# Altium project MarioKarCB.PrjPcb
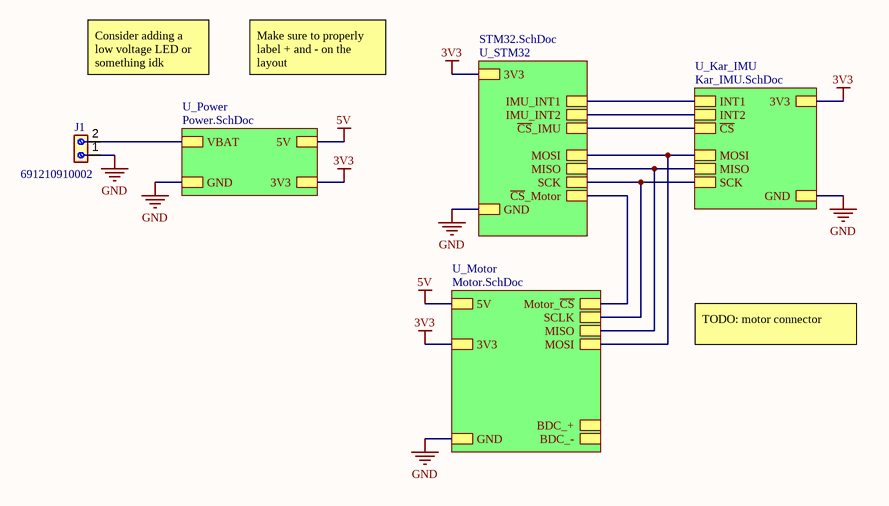
[diagram p0: Kar_PCB.SchDoc]
CAGE_CODE: ?????; CONTRACT_NUMBER: <CONTRACT NO>; DOC_NO_ASSY_DWG: <ASSY DWG NO>; DOC_NO_BOM: <BOM DOC NO>; DOC_NO_FAB_DWG: <FAB DWG NO>; DOC_NO_SCH_DWG: <SCH DWG NO>; PCB_2_DEC_TOL: +/-.01; PCB_3_DEC_TOL: +/-.010; PCB_ANG_TOL: +/-1/2; PCB_ASSEMBLY_NO: <PCB ASSY NO>; PCB_CHECKER: - -----; PCB_CHECKER_APP_DATE: --/--/----; PCB_DESIGNER: - -----; PCB_DESIGNER_APP_DATE: --/--/----; PCB_DWG_NO: <PCB DWG NO>; PCB_ENGINEER: - -----; PCB_ENGINEER_APP_DATE: --/--/----; PCB_PART_NUMBER: <PCB PN>; PCB_REV: A; SCH_REV: A
7 sheets, 72 parts. Net scope: strictly hierarchical (ports join the sheet entries above them; power ports are local).
Sheets:
  Kar_PCB.SchDoc
    U_Motor = Motor.SchDoc
    U_Power = Power.SchDoc
    U_STM32 = STM32.SchDoc
    U_Kar_IMU = Kar_IMU.SchDoc
  Finger_IMU_PCB.SchDoc
  Glove_PCB.SchDoc

## Sheet Kar_PCB.SchDoc
size 241 x 190 mm; SheetNumber: 1; SheetTotal: 5; ENG_APP_DATE: --/--/--; DSN_APP_DATE: --/--/--; CHK_APP_DATE: --/--/--

### Parts
J1  691210910002  [691210910002]

### Sub-sheets
U_Kar_IMU = Kar_IMU.SchDoc: 3V3, GND, ~{CS}, SCK, MISO, MOSI, INT1, INT2
U_Motor = Motor.SchDoc: 5V, GND, BDC_+, BDC_-, MOSI, Motor_~{CS}, SCLK, 3V3, MISO
U_Power = Power.SchDoc: VBAT, GND, 5V, 3V3
U_STM32 = STM32.SchDoc: MOSI, MISO, SCK, 3V3, GND, ~{CS}_Motor, ~{CS}_IMU, IMU_INT2, IMU_INT1

### Nets
3V3: sheet U_Motor/3V3, sheet U_Power/3V3, sheet U_STM32/3V3, sheet U_Kar_IMU/3V3
5V: sheet U_Motor/5V, sheet U_Power/5V
GND: J1.1 ; sheet U_Motor/GND, sheet U_Power/GND, sheet U_STM32/GND, sheet U_Kar_IMU/GND
VBAT: J1.2 ; sheet U_Power/VBAT
NetMT1_4: sheet U_STM32/IMU_INT1, sheet U_Kar_IMU/INT1
NetMT1_9: sheet U_STM32/IMU_INT2, sheet U_Kar_IMU/INT2
NetMT1_12: sheet U_STM32/~{CS}_IMU, sheet U_Kar_IMU/~{CS}
NetMT1_13: sheet U_Motor/SCLK, sheet U_STM32/SCK, sheet U_Kar_IMU/SCK
NetMT1_14: sheet U_Motor/MOSI, sheet U_STM32/MOSI, sheet U_Kar_IMU/MOSI
NetR12_1: sheet U_Motor/MISO, sheet U_STM32/MISO, sheet U_Kar_IMU/MISO
NetR?#3_2: sheet U_Motor/Motor_~{CS}, sheet U_STM32/~{CS}_Motor

### Notes on the sheet
- Consider adding a low voltage LED or something idk
- Make sure to properly label + and - on the layout
- TODO: motor connector
- DWG. NO.
- REV.
- SHT.
- THIS DOCUMENT AND THE DATA DISCLOSED HEREIN OR HEREWITH IS THE PROPERTY OF ALTIUM LIMITED AND MAY BE FREELY DISTRIBUTED IN WHOLE. NO RIGHTS ARE RESERVED OR EXPRESS OR IMPLIED WARANTEE GIVEN.
- REVISION
- DESCRIPTION
- DATE
- APPROVED
- ENG:
- APPROVALS
- PROJECT
- DSN:
- CHK:
- REFERENCE DOCUMENTS
- PROJECT REVISION:
- TITLE
- DOCUMENT REVISION:
- DESIGN ITEM:
- BOM:
- FAB DWG:
- PCB DWG:
- ASSY DWG:
- SCALE:
- SIZE
- B
- CAGE CODE
- FILE NAME
- DWG NO.
- SHEET
- OF
- REV

### Library data of the parts
J1 = 691210910002: MF: {'manufacturer': u'W\xfcrth Elektronik'}; Package: None; Price: None; Value: *; MP: 691210910002; Availability: Unavailable

## Sheet Motor.SchDoc
size A; SheetNumber: 3; SheetTotal: 7
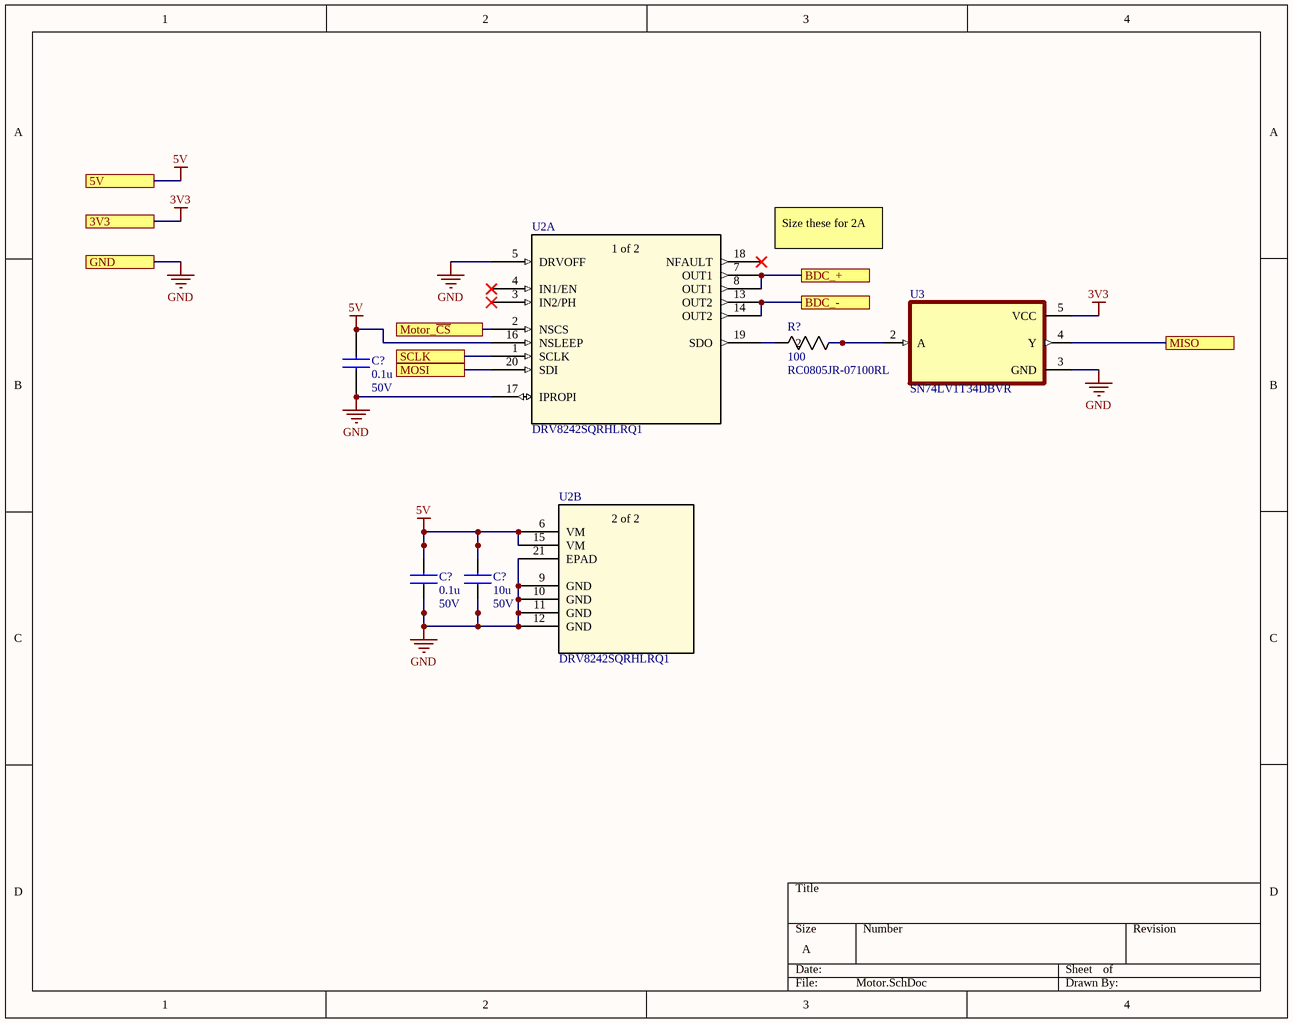
[diagram p1: Motor.SchDoc]

### Parts
(Parts that share a designator on the sheet are numbered #1, #2 ... from top to bottom, then left to right.)
C?#1  value 0.1u  Rated Voltage: 50V  [CAPC2012X145N]  (hidden comment: KAM21BR71H104JM)
C?#2  value 0.1u  Rated Voltage: 50V  [CAPC2012X145N]  (hidden comment: KAM21BR71H104JM)
C?#3  value 10u  Rated Voltage: 50V  [CAPC2012X145N]  (hidden comment: C2012X5R1H106K125AC)
R?#1  RC0805JR-07100RL  value 100  [RC0805N_YAG]
U2  DRV8242SQRHLRQ1  [VQFN20_RHL_TEX]  (parts A,B of 2)
U3  SN74LV1T34DBVR  [SOT95P280X145-5N]

### Ports
3V3, 5V, BDC_+, BDC_-, GND, MISO, MOSI, Motor_~{CS}, SCLK

### Nets
3V3: U3.5(VCC) ; port 3V3
5V: C?#1.2 C?#2.2 C?#3.2 U2.6(VM) U2.15(VM) U2.16(NSLEEP) ; port 5V
GND: C?#1.1 C?#2.1 C?#3.1 U2.5(DRVOFF) U2.9(GND) U2.10(GND) U2.11(GND) U2.12(GND) U2.17(IPROPI) U2.21(EPAD) U3.3(GND) ; port GND
NetMT1_13: U2.1(SCLK) ; port SCLK
NetMT1_14: U2.20(SDI) ; port MOSI
NetR12_1: U3.4(Y) ; port MISO
NetR?#1_1: R?#1.1 U3.2(A)
NetR?#1_2: R?#1.2 U2.19(SDO)
NetR?#3_2: U2.2(NSCS) ; port Motor_~{CS}
NetU2_7: U2.7(OUT1) U2.8(OUT1) ; port BDC_+
NetU2_13: U2.13(OUT2) U2.14(OUT2) ; port BDC_-

Not connected (* = marked no-connect by the designer): U2 3(IN2/PH)* 4(IN1/EN)* 18(NFAULT)*

### Notes on the sheet
- Size these for 2A
- (in symbol DRV8242SQRHLRQ1, part A) 1 of 2
- (in symbol DRV8242SQRHLRQ1, part B) 2 of 2

### Library data of the parts
C?#1 C?#2 = KAM21BR71H104JM: Multilayer Ceramic Chip Capacitors, Capacitance=0.1u; Manufacturer_Part_Number: KAM21BR71H104JM
C?#3 = C2012X5R1H106K125AC: Multilayer Ceramic Chip Capacitors, Capacitance=10?F, LxWxT:2x1.25x1.25mm; Manufacturer_Name: TDK; Geometry.Height: 1.45mm; Mouser Part Number: 810-C2012X5R1H106K12; Mouser Price/Stock: https://www.mouser.co.uk/ProductDetail/TDK/C2012X5R1H106K125AC?qs=rSMjJ%252B1ewcQGpfDVduhUmg%3D%3D; Manufacturer_Part_Number: C2012X5R1H106K125AC; Datasheet Link: https://product.tdk.com/info/en/catalog/datasheets/mlcc_commercial_midvoltage_en.pdf
R?#1 = RC0805JR-07100RL: RES 0805 100 5% 1/8W; Manufacturer_Name: Yageo; Manufacturer_Part_Number: RC0805JR-07100RL; Tolerance: 5%
U2 = DRV8242SQRHLRQ1: Automotive, 40-V 6-A H-bridge driver with integrated current sensing and feedback 20-VQFN -40 to 125; Manufacturer_Name: Texas Instruments; Type: Power Management; Copyright: Copyright (C) 2025 Ultra Librarian. All rights reserved.; Manufacturer_Part_Number: DRV8242SQRHLRQ1; Datasheet: https://www.ti.com/lit/gpn/drv8242-q1; RefDes: RefDes
U3 = SN74LV1T34DBVR: Single Power Supply BUFFER Logic Level Shifter (no enable); MF: Texas Instruments; SnapEDA_Link: https://www.snapeda.com/parts/SN74LV1T34DBVR/Texas+Instruments/view-part/?ref=snap; Package: SOT-23-5 Texas Instruments; Value: *; MP: SN74LV1T34DBVR; Check_prices: https://www.snapeda.com/parts/SN74LV1T34DBVR/Texas+Instruments/view-part/?ref=eda

## Sheet Power.SchDoc
size A; SheetNumber: 2; SheetTotal: 7
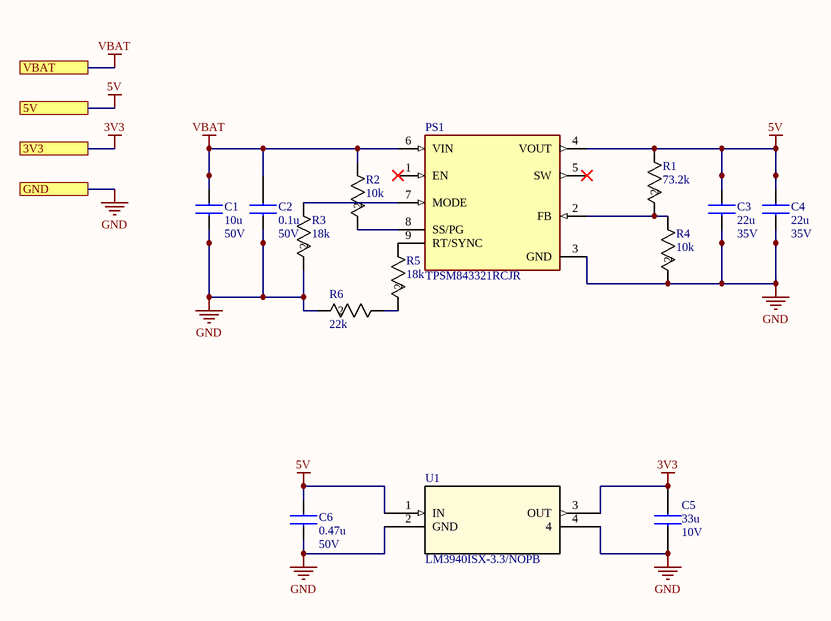
[diagram p2: Power.SchDoc]

### Parts
C1  value 10u  Rated Voltage: 50V  [CAPC2012X145N]  (hidden comment: C2012X5R1H106K125AC)
C2  value 0.1u  Rated Voltage: 50V  [CAPC2012X145N]  (hidden comment: KAM21BR71H104JM)
C3  value 22u  Rated Voltage: 35V  [CAPC2012X145N]  (hidden comment: C2012X5R1V226M125AC)
C4  value 22u  Rated Voltage: 35V  [CAPC2012X145N]  (hidden comment: C2012X5R1V226M125AC)
C5  value 33u  Rated Voltage: 10V  [CAPC2012X145N]  (hidden comment: C2012X5R1A336M125AC)
C6  value 0.47u  Rated Voltage: 50V  [CAPC2012X145N]  (hidden comment: GCM21BR71H474KA55K)
PS1  TPSM843321RCJR  [MODULE_TPSM843321RCJR]
R1  value 73.2k  [RC0805N_YAG]  (hidden comment: RC0805FR-0773K2L)
R2  value 10k  [RC0805N_YAG]  (hidden comment: RC0805FR-0710KL)
R3  value 18k  [RC0805N_YAG]  (hidden comment: RC0805FR-0718KL)
R4  value 10k  [RC0805N_YAG]  (hidden comment: RC0805FR-0710KL)
R5  value 18k  [RC0805N_YAG]  (hidden comment: RC0805FR-0718KL)
R6  value 22k  [RC0805N_YAG]  (hidden comment: RC0805FR-0722KL)
U1  LM3940ISX-3.3/NOPB  [TS3B]

### Ports
3V3, 5V, GND, VBAT

### Nets
3V3: C5.2 U1.3(OUT) ; port 3V3
5V: C3.2 C4.2 C6.2 PS1.4(VOUT) R1.1 U1.1(IN) ; port 5V
GND: C1.1 C2.1 C3.1 C4.1 C5.1 C6.1 PS1.3(GND) R3.2 R4.2 R6.2 U1.2(GND) U1.4 ; port GND
VBAT: C1.2 C2.2 PS1.6(VIN) R2.1 ; port VBAT
NetPS1_2: PS1.2(FB) R1.2 R4.1
NetPS1_7: PS1.7(MODE) R3.1
NetPS1_8: PS1.8(SS/PG) R2.2
NetPS1_9: PS1.9(RT/SYNC) R5.1
NetR5_2: R5.2 R6.1

Not connected (* = marked no-connect by the designer): PS1 1(EN)* 5(SW)*

### Library data of the parts
C1 = C2012X5R1H106K125AC: as C?#3 on sheet Motor; Mouser Part Number: 810-C2012X5R1H106K12; Mouser Price/Stock: https://www.mouser.co.uk/ProductDetail/TDK/C2012X5R1H106K125AC?qs=rSMjJ%252B1ewcQGpfDVduhUmg%3D%3D; Manufacturer_Part_Number: C2012X5R1H106K125AC; Datasheet Link: https://product.tdk.com/info/en/catalog/datasheets/mlcc_commercial_midvoltage_en.pdf
C2 = KAM21BR71H104JM: as C?#1 on sheet Motor; Manufacturer_Part_Number: KAM21BR71H104JM
C3 C4 = C2012X5R1V226M125AC: Multilayer Ceramic Chip Capacitors, Capacitance=22u; Manufacturer_Part_Number: C2012X5R1V226M125AC
C5 = C2012X5R1A336M125AC: Multilayer Ceramic Chip Capacitors, Capacitance=33u; Manufacturer_Part_Number: C2012X5R1A336M125AC
C6 = GCM21BR71H474KA55K: Multilayer Ceramic Chip Capacitors, Capacitance=0.47u; Manufacturer_Part_Number: GCM21BR71H474KA55K
PS1 = TPSM843321RCJR: Non-Isolated PoL Module DC DC Converter 1 Output 5V 3A 3.8V - 18V Input; MF: Texas Instruments; SnapEDA_Link: https://www.snapeda.com/parts/TPSM843321RCJR/Texas+Instruments/view-part/?ref=snap; Package: None; Value: *; MP: TPSM843321RCJR; Check_prices: https://www.snapeda.com/parts/TPSM843321RCJR/Texas+Instruments/view-part/?ref=eda
R1 = RC0805FR-0773K2L: RES 0805 73.2k 1% 1/8W; Manufacturer_Name: Yageo; Manufacturer_Part_Number: RC0805FR-0773K2L; Tolerance: 1%
R2 R4 = RC0805FR-0710KL: RES 0805 10k 1% 1/8W; Manufacturer_Name: Yageo; Manufacturer_Part_Number: RC0805FR-0710KL; Tolerance: 1%
R3 R5 = RC0805FR-0718KL: RES 0805 18k 1% 1/8W; Manufacturer_Name: Yageo; Manufacturer_Part_Number: RC0805FR-0718KL; Tolerance: 1%
R6 = RC0805FR-0722KL: RES 0805 22k 1% 1/8W; Manufacturer_Name: Yageo; Manufacturer_Part_Number: RC0805FR-0722KL; Tolerance: 1%
U1 = LM3940ISX-3.3NOPB: 1-A, low-dropout voltage regulator for 5-V to 3.3-V conversion 3-DDPAK/TO-263 -40 to 125; Manufacturer_Name: Texas Instruments; Type: LM3940IS-3.3; Copyright: Copyright (C) 2025 Ultra Librarian. All rights reserved.; Manufacturer_Part_Number: LM3940ISX-3.3/NOPB; Datasheet: https://www.ti.com/lit/gpn/lm3940; RefDes: RefDes

## Sheet STM32.SchDoc
size A; SheetNumber: 4; SheetTotal: 7
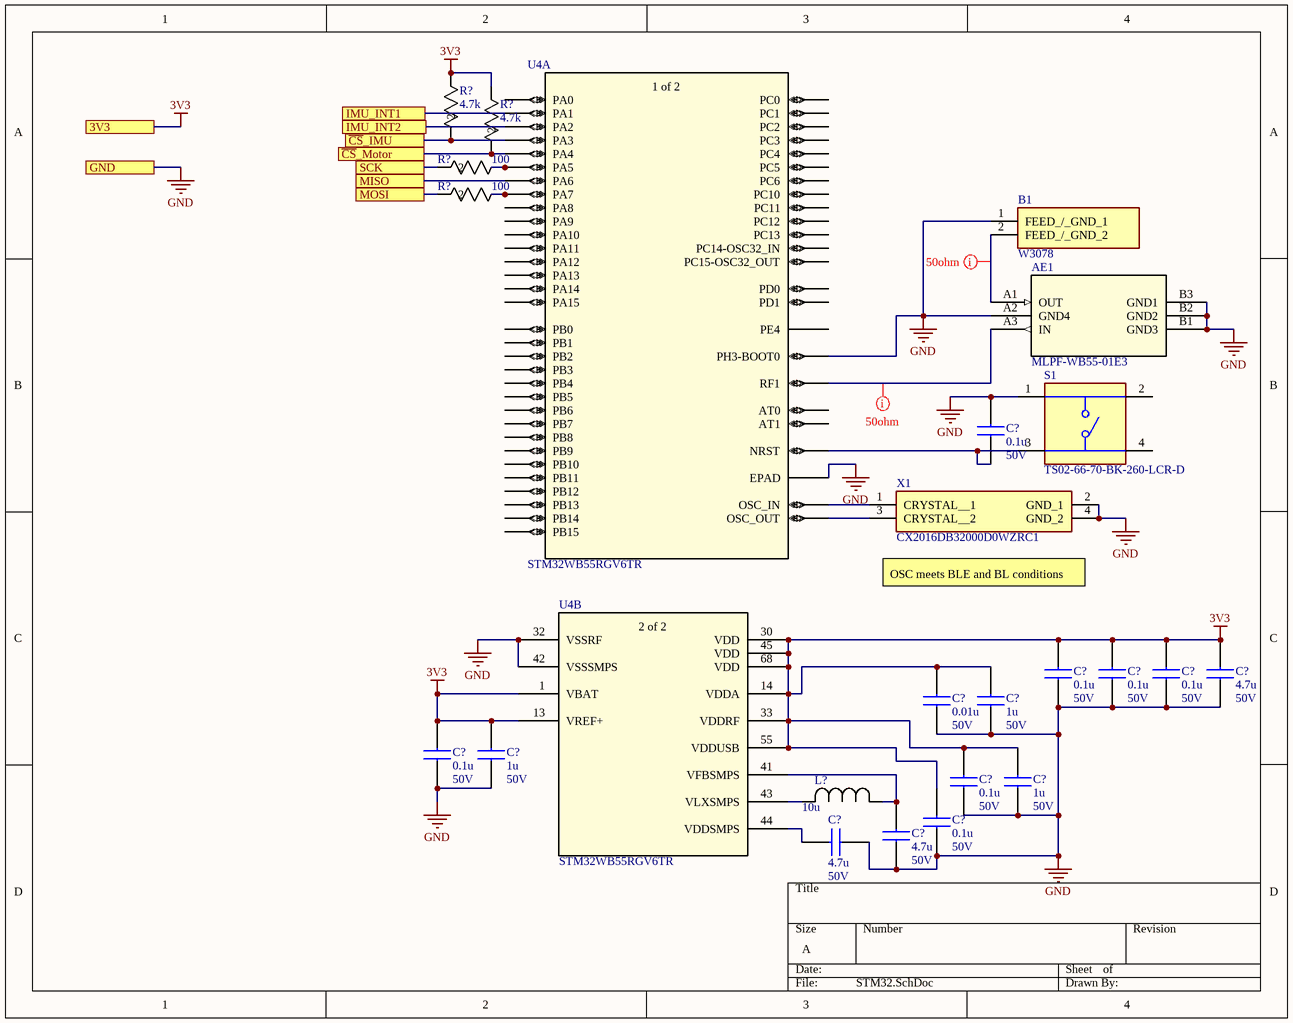
[diagram p3: STM32.SchDoc]

### Parts
(Parts that share a designator on the sheet are numbered #1, #2 ... from top to bottom, then left to right.)
AE1  MLPF-WB55-01E3  [MLPF-WB55-01E3_STM]
B1  W3078  [W3078]
C?#4  value 0.1u  Rated Voltage: 50V  [CAPC2012X145N]  (hidden comment: KAM21BR71H104JM)
C?#5  value 0.1u  Rated Voltage: 50V  [CAPC2012X145N]  (hidden comment: KAM21BR71H104JM)
C?#6  value 0.1u  Rated Voltage: 50V  [CAPC2012X145N]  (hidden comment: KAM21BR71H104JM)
C?#7  value 0.1u  Rated Voltage: 50V  [CAPC2012X145N]  (hidden comment: KAM21BR71H104JM)
C?#8  value 4.7u  Rated Voltage: 50V  [CAPC2012X145N]  (hidden comment: C2012X5R1H475M125AB)
C?#9  value 0.01u  Rated Voltage: 50V  [CAPC2012X145N]  (hidden comment: KAM21BR71H103KT)
C?#10  value 1u  Rated Voltage: 50V  [CAPC2012X145N]  (hidden comment: KGM21AR51H105KU)
C?#11  value 0.1u  Rated Voltage: 50V  [CAPC2012X145N]  (hidden comment: KAM21BR71H104JM)
C?#12  value 1u  Rated Voltage: 50V  [CAPC2012X145N]  (hidden comment: KGM21AR51H105KU)
C?#13  value 0.1u  Rated Voltage: 50V  [CAPC2012X145N]  (hidden comment: KAM21BR71H104JM)
C?#14  value 1u  Rated Voltage: 50V  [CAPC2012X145N]  (hidden comment: KGM21AR51H105KU)
C?#15  value 4.7u  Rated Voltage: 50V  [CAPC2012X145N]  (hidden comment: C2012X5R1H475M125AB)
C?#16  value 0.1u  Rated Voltage: 50V  [CAPC2012X145N]  (hidden comment: KAM21BR71H104JM)
C?#17  value 4.7u  Rated Voltage: 50V  [CAPC2012X145N]  (hidden comment: C2012X5R1H475M125AB)
L?  value 10u  [IND_LQM21FN100M80L_MUR]  (hidden comment: LQM21FN100M80L)
R?#2  value 4.7k  [RC0805N_YAG]  (hidden comment: RC0805JR-074K7L)
R?#3  value 4.7k  [RC0805N_YAG]  (hidden comment: RC0805JR-074K7L)
R?#4  value 100  [RC0805N_YAG]  (hidden comment: RC0805JR-07100RL)
R?#5  value 100  [RC0805N_YAG]  (hidden comment: RC0805JR-07100RL)
S1  TS02-66-70-BK-260-LCR-D  [SW_TS02-66-70-BK-260-LCR-D]
U4  STM32WB55RGV6TR  [VFQFN68-8x8mm]  (parts A,B of 2)
X1  CX2016DB32000D0WZRC1  [CX2016DB32000D0WZRC1]

### Ports
3V3, GND, IMU_INT1, IMU_INT2, MISO, MOSI, SCK, ~{CS}_IMU, ~{CS}_Motor

### Nets
3V3: C?#5.2 C?#6.2 C?#7.2 C?#8.2 C?#9.2 C?#10.2 C?#11.2 C?#12.2 C?#13.2 C?#14.2 C?#16.2 R?#2.1 R?#3.1 U4.1(VBAT) U4.13(VREF+) U4.14(VDDA) U4.30(VDD) U4.33(VDDRF) U4.45(VDD) U4.55(VDDUSB) U4.68(VDD) ; port 3V3
GND: AE1.A2(GND4) AE1.B1(GND3) AE1.B2(GND2) AE1.B3(GND1) B1.1(FEED_/_GND_1) C?#4.2 C?#5.1 C?#6.1 C?#7.1 C?#8.1 C?#9.1 C?#10.1 C?#11.1 C?#12.1 C?#13.1 C?#14.1 C?#15.1 C?#16.1 C?#17.1 S1.1 U4.5(PH3-BOOT0) U4.32(VSSRF) U4.42(VSSSMPS) U4.69(EPAD) X1.2(GND_1) X1.4(GND_2) ; port GND
NetAE1_A1: AE1.A1(OUT) B1.2(FEED_/_GND_2)
NetAE1_A3: AE1.A3(IN) U4.31(RF1)
NetC?#4_1: C?#4.1 S1.3 U4.8(NRST)
NetC?#15_2: C?#15.2 U4.44(VDDSMPS)
NetC?#17_2: C?#17.2 L?.1 U4.41(VFBSMPS)
NetL?_2: L?.2 U4.43(VLXSMPS)
NetMT1_4: U4.16(PA1) ; port IMU_INT1
NetMT1_9: U4.17(PA2) ; port IMU_INT2
NetMT1_12: R?#2.2 U4.18(PA3) ; port ~{CS}_IMU
NetMT1_13: R?#4.2 ; port SCK
NetMT1_14: R?#5.2 ; port MOSI
NetR12_1: U4.21(PA6) ; port MISO
NetR?#3_2: R?#3.2 U4.19(PA4) ; port ~{CS}_Motor
NetR?#4_1: R?#4.1 U4.20(PA5)
NetR?#5_1: R?#5.1 U4.22(PA7)
NetU4_34: U4.34(OSC_OUT) X1.3(CRYSTAL__2)
NetU4_35: U4.35(OSC_IN) X1.1(CRYSTAL__1)

Not connected (* = marked no-connect by the designer): S1 2 4; U4 2(PC13) 3(PC14-OSC32_IN) 4(PC15-OSC32_OUT) 6(PB8) 7(PB9) 9(PC0) 10(PC1) 11(PC2) 12(PC3) 15(PA0) 23(PA8) 24(PA9) 25(PC4) 26(PC5) 27(PB2) 28(PB10) 29(PB11) 36(AT0) 37(AT1) 38(PB0) 39(PB1) 40(PE4) 46(PB12) 47(PB13) 48(PB14) 49(PB15) 50(PC6) 51(PA10) 52(PA11) 53(PA12) 54(PA13) 56(PA14) 57(PA15) 58(PC10) 59(PC11) 60(PC12) 61(PD0) 62(PD1) 63(PB3) 64(PB4) 65(PB5) 66(PB6) 67(PB7)

### Layout directives
mark named 50ohm: NetAE1_A1, NetAE1_A3

### Notes on the sheet
- (near X1) OSC meets BLE and BL conditions
- (in symbol STM32WB55RGV6TR, part A) 1 of 2
- (in symbol STM32WB55RGV6TR, part B) 2 of 2

### Library data of the parts
AE1 = MLPF-WB55-01E3: 2.4 GHz Matched filter companion chip for STM32WB55Cx and STM32WB55Rx; Manufacturer_Name: STMicroelectronics; Copyright: Copyright (C) 2025 Ultra Librarian. All rights reserved.; Manufacturer_Part_Number: MLPF-WB55-01E3; Datasheet: https://www.st.com/resource/en/datasheet/mlpf-wb55-01e3.pdf; RefDes: RefDes; Type: Type
B1 = W3078: Antennas CERAMIC W3078 GC380H N; Manufacturer_Name: PULSE; Geometry.Height: 1.2mm; Mouser Part Number: 673-W3078; Mouser Price/Stock: https://www.mouser.co.uk/ProductDetail/Pulse-Electronics/W3078?qs=k0bvAmZt86CkgrK3%2FGxl6Q%3D%3D; Manufacturer_Part_Number: W3078; Datasheet Link: https://datasheet.datasheetarchive.com/originals/distributors/DKDS-10/182581.pdf
C?#4-C?#7 C?#11 C?#13 C?#16 = KAM21BR71H104JM: as C?#1 on sheet Motor; Manufacturer_Part_Number: KAM21BR71H104JM
C?#8 C?#15 C?#17 = C2012X5R1H475M125AB: Multilayer Ceramic Chip Capacitors, Capacitance=4.7u; Manufacturer_Part_Number: GCM21BR71H474KA55K
C?#9 = KAM21BR71H103KT: Multilayer Ceramic Chip Capacitors, Capacitance=0.01u; Manufacturer_Part_Number: KAM21BR71H103KT
C?#10 C?#12 C?#14 = KGM21AR51H105KU: Multilayer Ceramic Chip Capacitors, Capacitance=1u; Manufacturer_Part_Number: KGM21AR51H105KU
L? = LQM21FN100M80L: No Description Available; Manufacturer_Name: Murata; Copyright: Copyright (C) 2025 Ultra Librarian. All rights reserved.; Manufacturer_Part_Number: LQM21FN100M80L
R?#2 R?#3 = RC0805JR-074K7L: RES 0805 4.7k 5% 1/8W; Manufacturer_Name: Yageo; Manufacturer_Part_Number: RC0805JR-074K7L; Tolerance: 5%
R?#4 R?#5 = RC0805JR-07100RL: as R?#1 on sheet Motor; Manufacturer_Part_Number: RC0805JR-07100RL; Tolerance: 5%
S1 = TS02-66-70-BK-260-LCR-D: 6 x 6 mm, 7 mm Actuator Height, 260 gf, Black, Long Crimped, Through Hole, SPST, Tactile Switch; MF: Same Sky; SnapEDA_Link: https://www.snapeda.com/parts/TS02-66-70-BK-260-LCR-D/Same+Sky/view-part/?ref=snap; Package: None; Value: *; MP: TS02-66-70-BK-260-LCR-D; Check_prices: https://www.snapeda.com/parts/TS02-66-70-BK-260-LCR-D/Same+Sky/view-part/?ref=eda
U4 = STM32WB55RGV6TR: Ultra-low-power dual core Arm Cortex-M4 MCU 64 MHz, Cortex-M0+ 32 MHz with 1 Mbyte of Flash memory, Bluetooth LE 5.4, 802.15.4, Zigbee, Thread, Matter, USB, LCD, AES-256; Manufacturer_Name: STMicroelectronics; Copyright: Copyright (C) 2025 Ultra Librarian. All rights reserved.; Manufacturer_Part_Number: STM32WB55RGV6TR; Datasheet: https://www.st.com/resource/en/datasheet/stm32wb55cc.pdf; RefDes: RefDes; Type: Type
X1 = CX2016DB32000D0WZRC1: 32 MHz +/-25ppm Crystal 8pF 60 Ohms 4-SMD, No Lead; Manufacturer_Name: Kyocera AVX; Geometry.Height: 0.45mm; Mouser Part Number: 581-CX2016DB32DWZRC1; Mouser Price/Stock: https://www.mouser.co.uk/ProductDetail/KYOCERA-AVX/CX2016DB32000D0WZRC1?qs=mHG8nxlouK5LiZGb%2FcBxwg%3D%3D; Manufacturer_Part_Number: CX2016DB32000D0WZRC1; Datasheet Link: https://ele.kyocera.com/assets/products/crystal-device/cx2016db_e.pdf

## Sheet Kar_IMU.SchDoc
size A; SheetNumber: 5; SheetTotal: 7
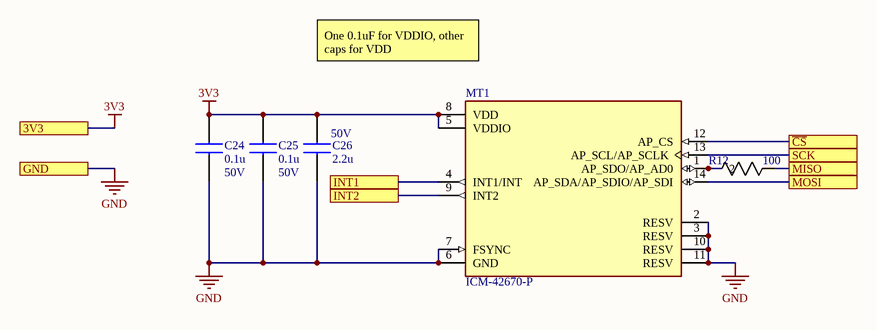
[diagram p4: Kar_IMU.SchDoc]

### Parts
C24  value 0.1u  Rated Voltage: 50V  [CAPC2012X145N]  (hidden comment: KAM21BR71H104JM)
C25  value 0.1u  Rated Voltage: 50V  [CAPC2012X145N]  (hidden comment: KAM21BR71H104JM)
C26  value 2.2u  Rated Voltage: 50V  [CAPC2012X145N]  (hidden comment: C2012X7R1H225K125AE)
MT1  ICM-42670-P  [XDCR_ICM-42670-P]
R12  value 100  [RC0805N_YAG]  (hidden comment: RC0805JR-07100RL)

### Ports
3V3, GND, INT1, INT2, MISO, MOSI, SCK, ~{CS}

### Nets
3V3: C24.2 C25.2 C26.2 MT1.5(VDDIO) MT1.8(VDD) ; port 3V3
GND: C24.1 C25.1 C26.1 MT1.2(RESV) MT1.3(RESV) MT1.6(GND) MT1.7(FSYNC) MT1.10(RESV) MT1.11(RESV) ; port GND
NetMT1_1: MT1.1(AP_SDO/AP_AD0) R12.2
NetMT1_4: MT1.4(INT1/INT) ; port INT1
NetMT1_9: MT1.9(INT2) ; port INT2
NetMT1_12: MT1.12(AP_CS) ; port ~{CS}
NetMT1_13: MT1.13(AP_SCL/AP_SCLK) ; port SCK
NetMT1_14: MT1.14(AP_SDA/AP_SDIO/AP_SDI) ; port MOSI
NetR12_1: R12.1 ; port MISO

### Notes on the sheet
- One 0.1uF for VDDIO, other caps for VDD

### Library data of the parts
C24 C25 = KAM21BR71H104JM: as C?#1 on sheet Motor; Manufacturer_Part_Number: KAM21BR71H104JM
C26 = C2012X7R1H225K125AE: Multilayer Ceramic Chip Capacitors, Capacitance=2.2u; Manufacturer_Part_Number: C2012X7R1H225K125AE
R12 = RC0805JR-07100RL: as R?#1 on sheet Motor; Manufacturer_Part_Number: RC0805JR-07100RL; Tolerance: 5%
MT1 = ICM-42670-P: Package: None; Price: None; Value: *; MP: ICM-42670-P; Availability: Unavailable

## Sheet Finger_IMU_PCB.SchDoc
size A; SheetNumber: 6; SheetTotal: 7
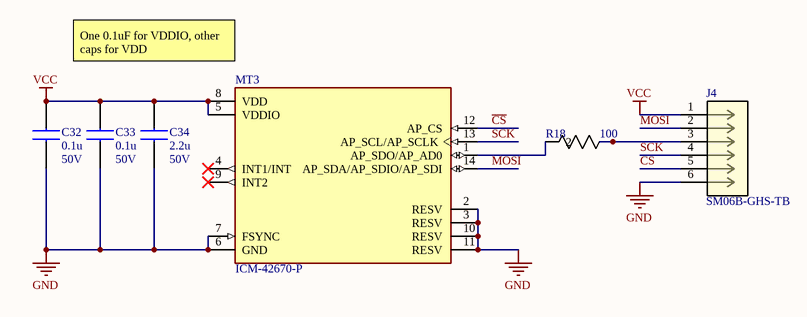
[diagram p5: Finger_IMU_PCB.SchDoc]

### Parts
C32  value 0.1u  Rated Voltage: 50V  [CAPC2012X145N]  (hidden comment: KAM21BR71H104JM)
C33  value 0.1u  Rated Voltage: 50V  [CAPC2012X145N]  (hidden comment: KAM21BR71H104JM)
C34  value 2.2u  Rated Voltage: 50V  [CAPC2012X145N]  (hidden comment: C2012X7R1H225K125AE)
J4  SM06B-GHS-TB  [CONN_SM06B-GHS-TB_JST]
MT3  ICM-42670-P  [XDCR_ICM-42670-P]
R18  value 100  [RC0805N_YAG]  (hidden comment: RC0805JR-07100RL)

### Nets
GND: C32.1 C33.1 C34.1 J4.6 MT3.2(RESV) MT3.3(RESV) MT3.6(GND) MT3.7(FSYNC) MT3.10(RESV) MT3.11(RESV)
VCC: C32.2 C33.2 C34.2 J4.1 MT3.5(VDDIO) MT3.8(VDD)
~{CS}: J4.5 MT3.12(AP_CS)
MOSI: J4.2 MT3.14(AP_SDA/AP_SDIO/AP_SDI)
SCK: J4.4 MT3.13(AP_SCL/AP_SCLK)
NetJ4_3: J4.3 R18.1
NetMT3_1: MT3.1(AP_SDO/AP_AD0) R18.2

Not connected (* = marked no-connect by the designer): MT3 4(INT1/INT)* 9(INT2)*

### Notes on the sheet
- (near MT3) One 0.1uF for VDDIO, other caps for VDD

### Library data of the parts
C32 C33 = KAM21BR71H104JM: as C?#1 on sheet Motor; Manufacturer_Part_Number: KAM21BR71H104JM
C34 = C2012X7R1H225K125AE: as C26 on sheet Kar_IMU; Manufacturer_Part_Number: C2012X7R1H225K125AE
J4 = SM06B-GHS-TB: No Description Available; Manufacturer_Name: JST; Copyright: Copyright (C) 2025 Ultra Librarian. All rights reserved.; Manufacturer_Part_Number: SM06B-GHS-TB; RefDes: RefDes; Type: Type
R18 = RC0805JR-07100RL: as R?#1 on sheet Motor; Manufacturer_Part_Number: RC0805JR-07100RL; Tolerance: 5%
MT3 = ICM-42670-P: Package: None; Price: None; Value: *; MP: ICM-42670-P; Availability: Unavailable

## Sheet Glove_PCB.SchDoc
size A; SheetNumber: 6; SheetTotal: 7
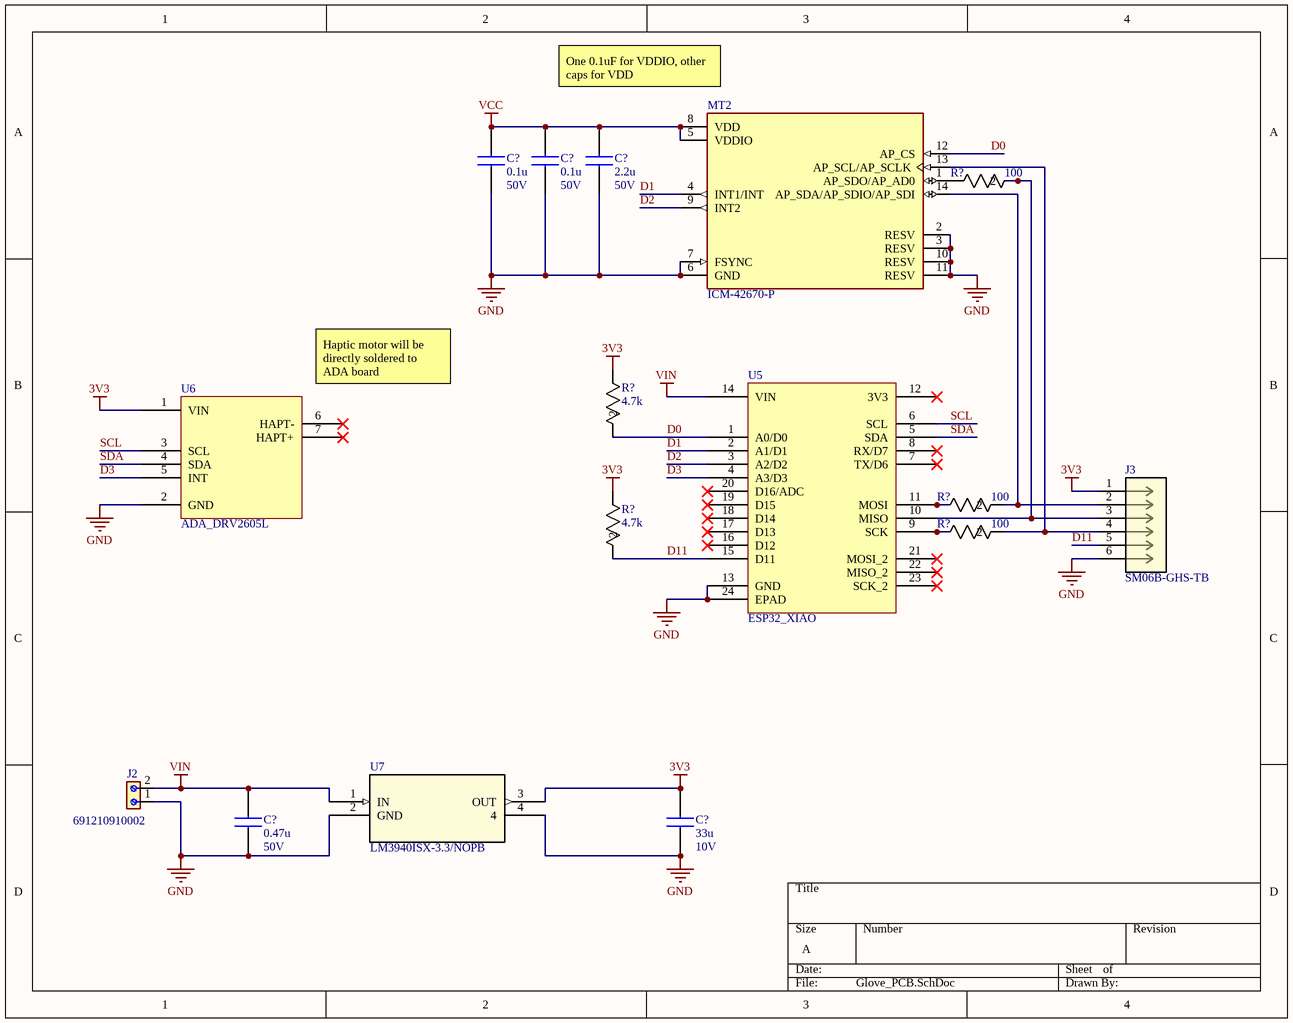
[diagram p6: Glove_PCB.SchDoc]

### Parts
(Parts that share a designator on the sheet are numbered #1, #2 ... from top to bottom, then left to right.)
C?#18  value 0.1u  Rated Voltage: 50V  [CAPC2012X145N]  (hidden comment: KAM21BR71H104JM)
C?#19  value 0.1u  Rated Voltage: 50V  [CAPC2012X145N]  (hidden comment: KAM21BR71H104JM)
C?#20  value 2.2u  Rated Voltage: 50V  [CAPC2012X145N]  (hidden comment: C2012X7R1H225K125AE)
C?#21  value 0.47u  Rated Voltage: 50V  [CAPC2012X145N]  (hidden comment: GCM21BR71H474KA55K)
C?#22  value 33u  Rated Voltage: 10V  [CAPC2012X145N]  (hidden comment: C2012X5R1A336M125AC)
J2  691210910002  [691210910002]
J3  SM06B-GHS-TB  [CONN_SM06B-GHS-TB_JST]
MT2  ICM-42670-P  [XDCR_ICM-42670-P]
R?#6  value 100  [RC0805N_YAG]  (hidden comment: RC0805JR-07100RL)
R?#7  value 4.7k  [RC0805N_YAG]  (hidden comment: RC0805JR-074K7L)
R?#8  value 100  [RC0805N_YAG]  (hidden comment: RC0805JR-07100RL)
R?#9  value 100  [RC0805N_YAG]  (hidden comment: RC0805JR-07100RL)
R?#10  value 4.7k  [RC0805N_YAG]  (hidden comment: RC0805JR-074K7L)
U5  ESP32_XIAO  [MOUDLE23P-SMD-2.54-21X17.8MM.kicad_mod.kicad_sym]
U6  ADA_DRV2605L  [ADA_DRV2605L]
U7  LM3940ISX-3.3/NOPB  [TS3B]

### Nets
3V3: C?#22.2 J3.1 R?#7.1 R?#10.1 U6.1(VIN) U7.3(OUT)
GND: C?#18.1 C?#19.1 C?#20.1 C?#21.1 C?#22.1 J2.1 J3.6 MT2.2(RESV) MT2.3(RESV) MT2.6(GND) MT2.7(FSYNC) MT2.10(RESV) MT2.11(RESV) U5.13(GND) U5.24(EPAD) U6.2(GND) U7.2(GND) U7.4
VCC: C?#18.2 C?#19.2 C?#20.2 MT2.5(VDDIO) MT2.8(VDD)
VIN: C?#21.2 J2.2 U5.14(VIN) U7.1(IN)
D0: MT2.12(AP_CS) R?#7.2 U5.1(A0/D0)
D1: MT2.4(INT1/INT) U5.2(A1/D1)
D2: MT2.9(INT2) U5.3(A2/D2)
D3: U5.4(A3/D3) U6.5(INT)
D11: J3.5 R?#10.2 U5.15(D11)
SCL: U5.6(SCL) U6.3(SCL)
SDA: U5.5(SDA) U6.4(SDA)
NetJ3_2: J3.2 MT2.14(AP_SDA/AP_SDIO/AP_SDI) R?#8.2
NetJ3_3: J3.3 R?#6.2 U5.10(MISO)
NetJ3_4: J3.4 MT2.13(AP_SCL/AP_SCLK) R?#9.2
NetMT2_1: MT2.1(AP_SDO/AP_AD0) R?#6.1
NetR?#8_1: R?#8.1 U5.11(MOSI)
NetR?#9_1: R?#9.1 U5.9(SCK)

Not connected (* = marked no-connect by the designer): U5 7(TX/D6)* 8(RX/D7)* 12(3V3)* 16(D12)* 17(D13)* 18(D14)* 19(D15)* 20(D16/ADC)* 21(MOSI_2)* 22(MISO_2)* 23(SCK_2)*; U6 6(HAPT-)* 7(HAPT+)*

### Notes on the sheet
- (near MT2) One 0.1uF for VDDIO, other caps for VDD
- (near U6) Haptic motor will be directly soldered to ADA board

### Library data of the parts
C?#18 C?#19 = KAM21BR71H104JM: as C?#1 on sheet Motor; Manufacturer_Part_Number: KAM21BR71H104JM
C?#20 = C2012X7R1H225K125AE: as C26 on sheet Kar_IMU; Manufacturer_Part_Number: C2012X7R1H225K125AE
C?#21 = GCM21BR71H474KA55K: as C6 on sheet Power; Manufacturer_Part_Number: GCM21BR71H474KA55K
C?#22 = C2012X5R1A336M125AC: as C5 on sheet Power; Manufacturer_Part_Number: C2012X5R1A336M125AC
J2 = 691210910002: as J1 on sheet Kar_PCB; Package: None; Price: None; Value: *; MP: 691210910002; Availability: Unavailable
J3 = SM06B-GHS-TB: as J4 on sheet Finger_IMU_PCB; Copyright: Copyright (C) 2025 Ultra Librarian. All rights reserved.; Manufacturer_Part_Number: SM06B-GHS-TB; RefDes: RefDes; Type: Type
R?#6 R?#8 R?#9 = RC0805JR-07100RL: as R?#1 on sheet Motor; Manufacturer_Part_Number: RC0805JR-07100RL; Tolerance: 5%
R?#7 R?#10 = RC0805JR-074K7L: as R?#2 on sheet STM32; Manufacturer_Part_Number: RC0805JR-074K7L; Tolerance: 5%
U7 = LM3940ISX-3.3NOPB: as U1 on sheet Power; Type: LM3940IS-3.3; Copyright: Copyright (C) 2025 Ultra Librarian. All rights reserved.; Manufacturer_Part_Number: LM3940ISX-3.3/NOPB; Datasheet: https://www.ti.com/lit/gpn/lm3940; RefDes: RefDes
MT2 = ICM-42670-P: Package: None; Price: None; Value: *; MP: ICM-42670-P; Availability: Unavailable

## Nets that join several sheets
3V3: Motor (U3.5), Power (C5.2 U1.3), STM32 (21 pins), Kar_IMU (5 pins)
5V: Motor (6 pins), Power (6 pins)
GND: Kar_PCB (J1.1), Motor (11 pins), Power (12 pins), STM32 (26 pins), Kar_IMU (9 pins)
VBAT: Kar_PCB (J1.2), Power (C1.2 C2.2 PS1.6 R2.1)
NetMT1_4: STM32 (U4.16), Kar_IMU (MT1.4)
NetMT1_9: STM32 (U4.17), Kar_IMU (MT1.9)
NetMT1_12: STM32 (R?#2.2 U4.18), Kar_IMU (MT1.12)
NetMT1_13: Motor (U2.1), STM32 (R?#4.2), Kar_IMU (MT1.13)
NetMT1_14: Motor (U2.20), STM32 (R?#5.2), Kar_IMU (MT1.14)
NetR12_1: Motor (U3.4), STM32 (U4.21), Kar_IMU (R12.1)
NetR?#3_2: Motor (U2.2), STM32 (R?#3.2 U4.19)